# Altium schematic sheet AFE.SchDoc
size A4
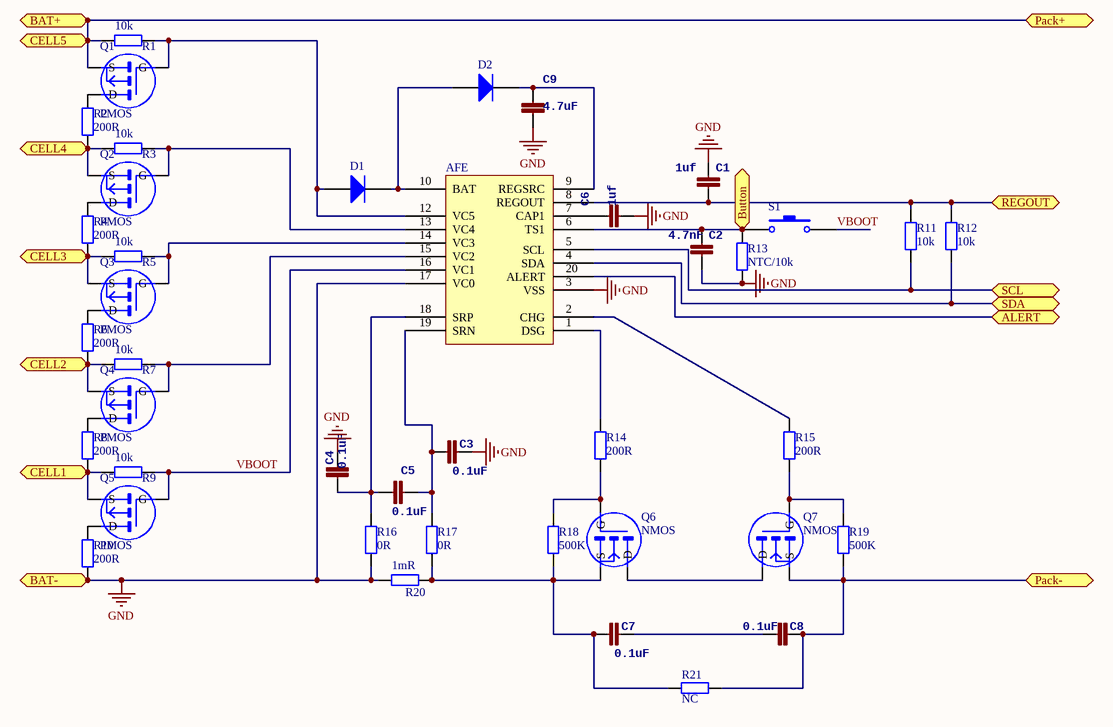
[diagram p0: AFE.SchDoc]

## Parts
AFE  BQ76920  [TSSOP20]  (value not drawn)
C1  1uf  [0603]
C2  4.7nF  [0603]
C3  0.1uF  [0603]
C4  0.1uF  [0603]
C5  0.1uF  [0603]
C6  1uf  [0603]
C7  0.1uF  [0603]
C8  0.1uF  [0603]
C9  4.7uF  [0805]
D1  Diode  [0805]  (value not drawn)
D2  Diode  [0805]  (value not drawn)
Q1  PMOS  [SOT-23B_L]
Q2  PMOS  [SOT-23B_L]
Q3  PMOS  [SOT-23B_L]
Q4  PMOS  [SOT-23B_L]
Q5  PMOS  [SOT-23B_L]
Q6  NMOS  [BSC025N03MS]
Q7  NMOS  [BSC025N03MS]
R1  10k  [0603]
R2  200R  [0603*6]
R3  10k  [0603]
R4  200R  [0603*6]
R5  10k  [0603]
R6  200R  [0603*6]
R7  10k  [0603]
R8  200R  [0603*6]
R9  10k  [0603]
R10  200R  [0603*6]
R11  10k  [0603]
R12  10k  [0603]
R13  NTC/10k  [0603]
R14  200R  [0603]
R15  200R  [0603]
R16  0R  [0603]
R17  0R  [0603]
R18  500K  [0603]
R19  500K  [0603]
R20  1mR  [2512]
R21  NC  [0603]
S1  SW-PB  [SW1]  (value not drawn)

## Ports
ALERT, BAT+, BAT-, Button, CELL1, CELL2, CELL3, CELL4, CELL5, Pack+, Pack-, REGOUT, SCL, SDA

## Nets
GND: AFE.3(VSS) AFE.17(VC0) C1.1 C2.2 C3.1 C4.1 C6.1 C9.1 R10.2 R13.2 R16.2 R20.2 ; port BAT-
ALERT: AFE.20(ALERT) ; port ALERT
BAT+: Q1.S R1.2 ; port CELL5, port BAT+, port Pack+
Button: AFE.6(TS1) C2.1 R13.1 S1.1 ; port Button
CELL1: Q5.S R8.2 R9.2 ; port CELL1
CELL2: Q4.S R6.2 R7.2 ; port CELL2
CELL3: Q3.S R4.2 R5.2 ; port CELL3
CELL4: Q2.S R2.2 R3.2 ; port CELL4
Pack-: C8.1 Q7.S R19.2 R21.2 ; port Pack-
REGOUT: AFE.8(REGOUT) C1.2 R11.1 R12.1 ; port REGOUT
SCL: AFE.5(SCL) R11.2 ; port SCL
SDA: AFE.4(SDA) R12.2 ; port SDA
VBOOT: AFE.16(VC1) Q5.G R9.1 S1.2
NetAFE_1: AFE.1(DSG) R14.1
NetAFE_2: AFE.2(CHG) R15.1
NetAFE_7: AFE.7(CAP1) C6.2
NetAFE_9: AFE.9(REGSRC) C9.2 D2.2(K)
NetAFE_10: AFE.10(BAT) D1.2(K) D2.1(A)
NetAFE_12: AFE.12(VC5) D1.1(A) Q1.G R1.1
NetAFE_13: AFE.13(VC4) Q2.G R3.1
NetAFE_14: AFE.14(VC3) Q3.G R5.1
NetAFE_15: AFE.15(VC2) Q4.G R7.1
NetAFE_18: AFE.18(SRP) C4.2 C5.2 R16.1
NetAFE_19: AFE.19(SRN) C3.2 C5.1 R17.1
NetC7_1: C7.1 C8.2
NetC7_2: C7.2 Q6.S R17.2 R18.2 R20.1 R21.1
NetQ1_D: Q1.D R2.1
NetQ2_D: Q2.D R4.1
NetQ3_D: Q3.D R6.1
NetQ4_D: Q4.D R8.1
NetQ5_D: Q5.D R10.1
NetQ6_D: Q6.D Q7.D
NetQ6_G: Q6.G R14.2 R18.1
NetQ7_G: Q7.G R15.2 R19.1

## Library data of the parts
C1-C9 = CAP0402-CAP: 电容; PARTNO: CC0402ZRY5V7BB104
D1 D2 = Diode: Default Diode; Published: 8-Jun-2000; LatestRevisionDate: 17-Jul-2002; LatestRevisionNote: Re-released for DXP Platform.; PackageVersion: Sep-1996; PackageReference: SMC; Publisher: Altium Limited; PackageDescription: DO-214-AB/SMC; 2 C-Bend Leads; Body 7.9 x 5.9 mm, inc. leads (LxW); Code_JEDEC: DO-214-AB
Q1-Q5 = PMOS: pin to pad: D>3 G>1 S>2
R1-R21 = Res2: 电阻; Value: 0Ohm; Published: 8-Jun-2000; LatestRevisionDate: 17-Jul-2002; LatestRevisionNote: Re-released for DXP Platform.; PackageReference: AXIAL-0.4; Publisher: Altium Limited; PackageDescription: Axial Device, Thru-Hole; 2 Leads; 0.4 in Pin Spacing
S1 = SW-PB: Switch; Published: 24-Mar-1999; LatestRevisionDate: 17-Jul-2002; LatestRevisionNote: Re-released for DXP Platform.; PackageReference: SPST-2; Publisher: Altium Limited; PackageDescription: Switch; 2 Leads